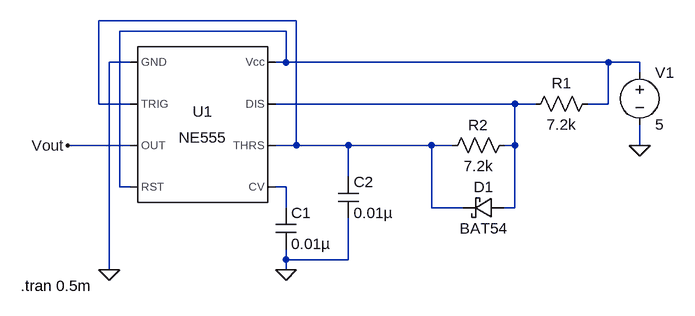
[diagram p0: schematic Astable_50.asc]
Astable_50.asc, the LTspice schematic file:
Version 4
SHEET 1 880 680
WIRE 240 -176 -64 -176
WIRE 224 -160 -32 -160
WIRE -16 -112 -48 -112
WIRE 224 -112 224 -160
WIRE 224 -112 208 -112
WIRE 720 -112 224 -112
WIRE 768 -112 720 -112
WIRE 768 -96 768 -112
WIRE -64 -48 -64 -176
WIRE -16 -48 -64 -48
WIRE 576 -48 208 -48
WIRE 608 -48 576 -48
WIRE 720 -48 720 -112
WIRE 720 -48 688 -48
WIRE -16 16 -112 16
WIRE 240 16 240 -176
WIRE 240 16 208 16
WIRE 320 16 240 16
WIRE 448 16 320 16
WIRE 480 16 448 16
WIRE 576 16 576 -48
WIRE 576 16 560 16
WIRE 768 16 768 -16
WIRE 320 64 320 16
WIRE -32 80 -32 -160
WIRE -16 80 -32 80
WIRE 224 80 208 80
WIRE 224 112 224 80
WIRE 448 112 448 16
WIRE 496 112 448 112
WIRE 576 112 576 16
WIRE 576 112 560 112
WIRE 224 192 224 176
WIRE 320 192 320 128
WIRE 320 192 224 192
WIRE -48 208 -48 -112
WIRE 224 208 224 192
FLAG 224 208 0
FLAG -48 208 0
FLAG 768 16 0
FLAG -112 16 Vout
SYMBOL Misc\\NE555 96 -16 R0
SYMATTR InstName U1
SYMBOL cap 208 112 R0
SYMATTR InstName C1
SYMATTR Value 0.01µ
SYMBOL voltage 768 -112 R0
WINDOW 123 0 0 Left 0
WINDOW 39 0 0 Left 0
SYMATTR InstName V1
SYMATTR Value 5
SYMBOL res 704 -64 R90
WINDOW 0 0 56 VBottom 2
WINDOW 3 32 56 VTop 2
SYMATTR InstName R1
SYMATTR Value 7.2k
SYMBOL res 576 0 R90
WINDOW 0 0 56 VBottom 2
WINDOW 3 32 56 VTop 2
SYMATTR InstName R2
SYMATTR Value 7.2k
SYMBOL cap 304 64 R0
SYMATTR InstName C2
SYMATTR Value 0.01µ
SYMBOL schottky 560 96 R90
WINDOW 0 0 32 VBottom 2
WINDOW 3 32 32 VTop 2
SYMATTR InstName D1
SYMATTR Value BAT54
SYMATTR Description Diode
SYMATTR Type diode
TEXT -184 232 Left 2 !.tran 0.5m

The netlist it stands for:
* Astable_50.asc
XU1 0 N001 Vout N002 N004 N001 N003 N002 NE555  ; pins GND TRIG OUT RST CV THRS DIS Vcc
C1 N004 0 0.01µ
V1 N002 0 5
R1 N002 N003 7.2k
R2 N003 N001 7.2k
C2 N001 0 0.01µ
D1 N003 N001 BAT54
.model D D
.lib standard.dio
.tran 0.5m
.lib NE555.sub
.backanno
.end